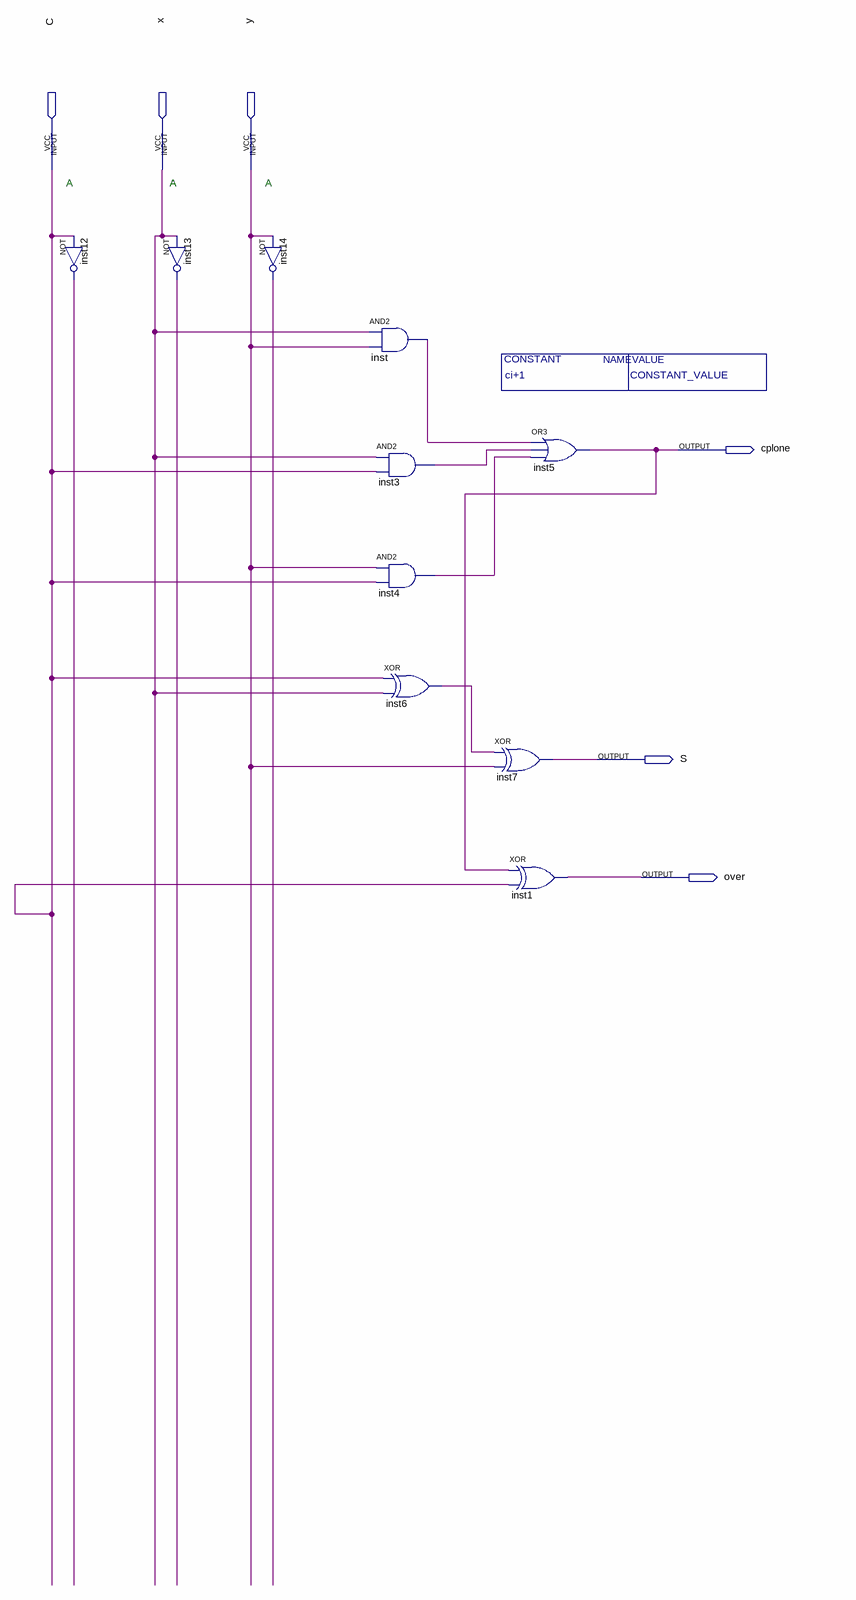
[diagram p0: schematic sheet]
// Quartus schematic adder.bdf as structural Verilog: 10 symbols, 6 pins
module adder #(parameter \ci+1  = "CONSTANT_VALUE") (
  input  C,
  input  x,
  input  y,
  output cplone,
  output S,
  output over
);

  wire inst3_out, inst4_out, inst6_out, inst12_out, inst13_out, inst14_out, inst_out;

  not inst12 (inst12_out, C);
  not inst13 (inst13_out, x);
  not inst14 (inst14_out, y);
  and inst (inst_out, x, y);
  and inst3 (inst3_out, x, C);
  and inst4 (inst4_out, y, C);
  xor inst6 (inst6_out, C, x);
  xor inst7 (S, inst6_out, y);
  xor inst1 (over, cplone, C);
  or inst5 (cplone, inst_out, inst3_out, inst4_out);

  // Notes on the sheet:
  //   A
  //   A
  //   A
endmodule
